# EAGLE schematic stepper-single (EAGLE 4.16)
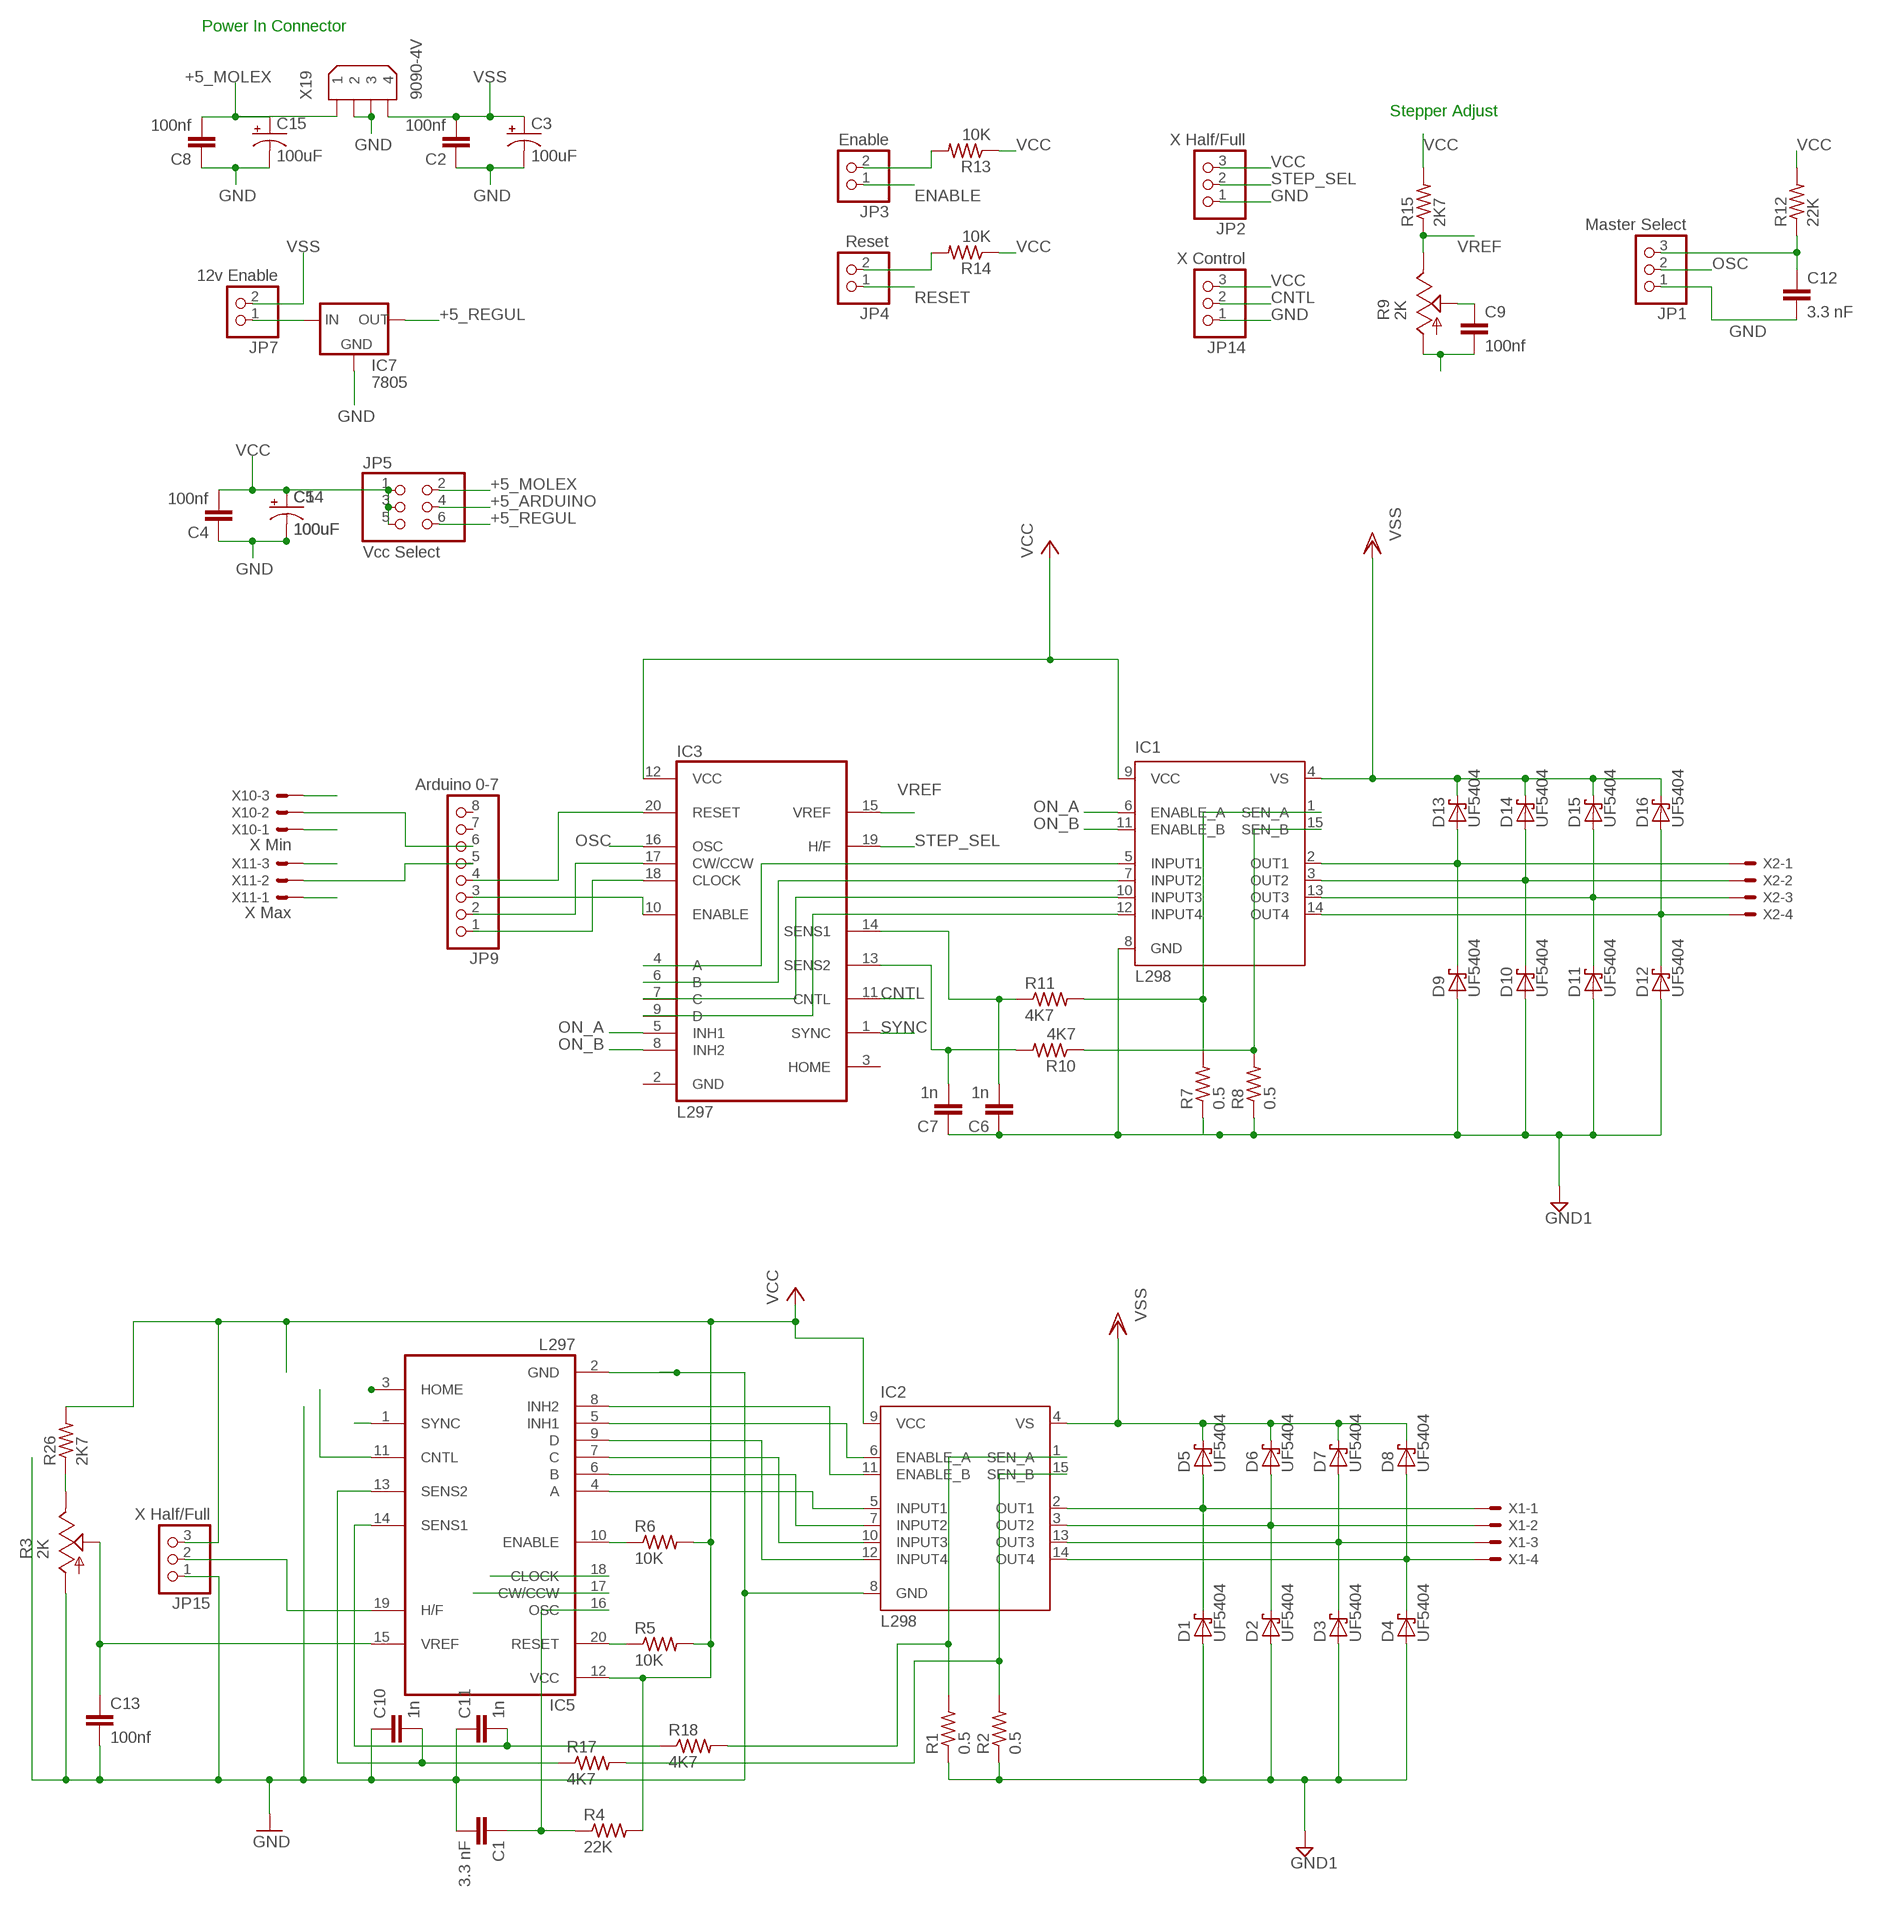
[diagram p0: schematic, sheet 1]

## Parts
C1  3.3 nF  C5/3.5  [C5B3.5]
C2  100nf  C-EU050-025X075  [C050-025X075]
C3  100uF  CPOL-USE5-6  [E5-6]
C4  100nf  C-EU050-025X075  [C050-025X075]
C5  100uF  CPOL-USE5-6  [E5-6]
C6  1n  C-EU050-030X075  [C050-030X075]
C7  1n  C-EU050-030X075  [C050-030X075]
C8  100nf  C-EU050-025X075  [C050-025X075]
C9  100nf  C-EU050-035X075  [C050-035X075]
C10  1n  C-EU050-030X075  [C050-030X075]
C11  1n  C-EU050-030X075  [C050-030X075]
C12  3.3 nF  C5/3.5  [C5B3.5]
C13  100nf  C-EU050-035X075  [C050-035X075]
C14  100uF  CPOL-USE5-6  [E5-6]
C15  100uF  CPOL-USE5-6  [E5-6]
D1  UF5404  SCHOTTKY-DIODECB429-15  [CB429-15]
D2  UF5404  SCHOTTKY-DIODECB429-15  [CB429-15]
D3  UF5404  SCHOTTKY-DIODECB429-15  [CB429-15]
D4  UF5404  SCHOTTKY-DIODECB429-15  [CB429-15]
D5  UF5404  SCHOTTKY-DIODECB429-15  [CB429-15]
D6  UF5404  SCHOTTKY-DIODECB429-15  [CB429-15]
D7  UF5404  SCHOTTKY-DIODECB429-15  [CB429-15]
D8  UF5404  SCHOTTKY-DIODECB429-15  [CB429-15]
D9  UF5404  SCHOTTKY-DIODECB429-15  [CB429-15]
D10  UF5404  SCHOTTKY-DIODECB429-15  [CB429-15]
D11  UF5404  SCHOTTKY-DIODECB429-15  [CB429-15]
D12  UF5404  SCHOTTKY-DIODECB429-15  [CB429-15]
D13  UF5404  SCHOTTKY-DIODECB429-15  [CB429-15]
D14  UF5404  SCHOTTKY-DIODECB429-15  [CB429-15]
D15  UF5404  SCHOTTKY-DIODECB429-15  [CB429-15]
D16  UF5404  SCHOTTKY-DIODECB429-15  [CB429-15]
IC1  L298  [MULTIWATT-15]
IC2  L298  [MULTIWATT-15]
IC3  L297  [DIL20]
IC5  L297  [DIL20]
IC7  7805  78XXS  [78XXS]
JP1  Master Select  PINHD-1X3  [1X03]
JP2  X Half/Full  PINHD-1X3  [1X03]
JP3  Enable  PINHD-1X2  [1X02]
JP4  Reset  PINHD-1X2  [1X02]
JP5  Vcc Select  PINHD-2X3  [2X03]
JP7  12v Enable  PINHD-1X2  [1X02]
JP9  Arduino 0-7  PINHD-1X8  [1X08]
JP14  X Control  PINHD-1X3  [1X03]
JP15  X Half/Full  PINHD-1X3  [1X03]
R1  0.5  R-US_0309/12  [0309/12]
R2  0.5  R-US_0309/12  [0309/12]
R3  2K  TRIM_US-B25U  [B25U]
R4  22K  R-US_0204/7  [0204/7]
R5  10K  R-US_0207/10  [0207/10]
R6  10K  R-US_0207/10  [0207/10]
R7  0.5  R-US_0309/12  [0309/12]
R8  0.5  R-US_0309/12  [0309/12]
R9  2K  TRIM_US-B25U  [B25U]
R10  4K7  R-US_0207/7  [0207/7]
R11  4K7  R-US_0207/7  [0207/7]
R12  22K  R-US_0204/7  [0204/7]
R13  10K  R-US_0207/7  [0207/7]
R14  10K  R-US_0207/7  [0207/7]
R15  2K7  R-US_0207/7  [0207/7]
R17  4K7  R-US_0207/7  [0207/7]
R18  4K7  R-US_0207/7  [0207/7]
R26  2K7  R-US_0207/7  [0207/7]
X1  KK-156-4  [KK-156-4]
X2  KK-156-4  [KK-156-4]
X10  X Min  22-23-2031  [22-23-2031]
X11  X Max  22-23-2031  [22-23-2031]
X19  9090-4V  [9090-4V]

## Nets
+5_ARDUINO: JP5.4
+5_MOLEX: C8.2 C15.+ JP5.2 X19.1
+5_REGUL: IC7.OUT JP5.6
CNTL [Power]: IC3.11(CNTL) JP14.2
ENABLE: JP3.1
GND [Ground]: C1.2 C2.1 C3.- C4.1 C5.- C8.1 C9.2 C10.1 C11.1 C12.2 C13.2 C14.- C15.- IC2.8(GND) IC5.2(GND) IC7.GND JP1.1 JP2.1 JP14.1 JP15.1 R3.A R9.A X19.2 X19.3
GND1 [Power]: C6.1 C7.1 D1.A D2.A D3.A D4.A D9.A D10.A D11.A D12.A IC1.8(GND) R1.1 R2.1 R7.1 R8.1
N$1: IC2.11(ENABLE_B) IC5.8(INH2)
N$2: IC2.6(ENABLE_A) IC5.5(INH1)
N$3: IC2.12(INPUT4) IC5.9(D)
N$4: IC2.10(INPUT3) IC5.7(C)
N$5: IC2.7(INPUT2) IC5.6(B)
N$6: IC2.5(INPUT1) IC5.4(A)
N$7: C1.1 IC5.16(OSC) R4.1
N$8: C11.2 IC5.14(SENS1) R18.1
N$9: IC2.15(SEN_B) R2.2 R17.2
N$10: IC5.17(CW/CCW)
N$11: IC5.18(CLOCK)
N$12: IC2.1(SEN_A) R1.2 R18.2
N$13 [Power]: D4.C D8.A IC2.14(OUT4) X1.4
N$14: IC5.10(ENABLE) R6.1
N$15: IC5.20(RESET) R5.1
N$16: X10.3
N$17: IC7.IN JP7.1
N$18: IC5.19(H/F) JP15.2
N$19: IC3.18(CLOCK) JP9.1
N$20 [Power]: D3.C D7.A IC2.13(OUT3) X1.3
N$21: R3.E R26.1
N$22 [Power]: D2.C D6.A IC2.3(OUT2) X1.2
N$23: IC3.17(CW/CCW) JP9.2
N$24: X10.1
N$25: IC1.5(INPUT1) IC3.4(A)
N$26: IC1.7(INPUT2) IC3.6(B)
N$27 [Power]: D12.C D16.A IC1.14(OUT4) X2.4
N$28 [Power]: D11.C D15.A IC1.13(OUT3) X2.3
N$29 [Power]: D10.C D14.A IC1.3(OUT2) X2.2
N$30 [Power]: D9.C D13.A IC1.2(OUT1) X2.1
N$31: IC1.10(INPUT3) IC3.7(C)
N$32: IC1.15(SEN_B) R8.2 R10.1
N$33: IC1.1(SEN_A) R7.2 R11.2
N$34: IC1.12(INPUT4) IC3.9(D)
N$35: IC3.10(ENABLE) JP9.3
N$36: C7.2 IC3.13(SENS2) R10.2
N$37: C6.2 IC3.14(SENS1) R11.1
N$38: JP9.6 X10.2
N$39: IC3.20(RESET) JP9.4
N$40: JP3.2 R13.2
N$41: C12.1 JP1.3 R12.1
N$42: JP4.2 R14.2
N$43: JP9.5 X11.2
N$44: X11.3
N$45: X11.1
N$46: C9.1 R9.S
N$75 [Power]: D1.C D5.A IC2.2(OUT1) X1.1
N$76: C10.2 IC5.13(SENS2) R17.1
N$77: C13.1 IC5.15(VREF) R3.S
N$78: IC5.11(CNTL)
N$95: IC5.3(HOME)
N$103: IC5.1(SYNC)
ON_A: IC1.6(ENABLE_A) IC3.5(INH1)
ON_B: IC1.11(ENABLE_B) IC3.8(INH2)
OSC: IC3.16(OSC) JP1.2
RESET: JP4.1
STEP_SEL: IC3.19(H/F) JP2.2
SYNC: IC3.1(SYNC)
VCC: C4.2 C5.+ C14.+ IC1.9(VCC) IC2.9(VCC) IC3.12(VCC) IC5.12(VCC) JP2.3 JP5.1 JP5.3 JP5.5 JP14.3 JP15.3 R4.2 R5.2 R6.2 R12.2 R13.1 R14.1 R15.2 R26.2
VREF: IC3.15(VREF) R9.E R15.1
VSS [Power]: C2.2 C3.+ D5.C D6.C D7.C D8.C D13.C D14.C D15.C D16.C IC1.4(VS) IC2.4(VS) JP7.2 X19.4
Unconnected: IC3.3(HOME) JP9.7 JP9.8

## Notes on the sheet
- Power In Connector
- Stepper Adjust

## Power pins joined to a net without a drawn wire
GND: IC3.2(GND)

## Library data of the parts
C1 C12 = capacitor-wima:C: CAPACITOR naming: grid - package width
C2 C4 C6-C11 C13 = rcl:C-EU: CAPACITOR, European symbol
C3 C5 C14 C15 = rcl:CPOL-US: POLARIZED CAPACITOR, American symbol
D1-D16 = diode:SCHOTTKY-DIODE: Schottky Diode
IC1 IC2 = st-microelectronics:L298: DUAL FULL-BRIDGE DRIVER
IC3 IC5 = st-microelectronics:L297: STEPPER MOTOR CONTROLLER
IC7 = cls:78XXS: VOLTAGE REGULATOR
JP1 JP2 JP14 JP15 = pinhead:PINHD-1X3: PIN HEADER
JP3 JP4 JP7 = pinhead:PINHD-1X2: PIN HEADER
JP5 = pinhead:PINHD-2X3: PIN HEADER
JP9 = pinhead:PINHD-1X8: PIN HEADER
R1 R2 R4-R8 R10-R15 R17 R18 R26 = rcl:R-US_: RESISTOR, American symbol
R3 R9 = pot:TRIM_US-: POTENTIOMETER
X1 X2 = con-molex:KK-156-4: KK 156 HEADER Source: http://www.molex.com/pdm_docs/sd/026604100_sd.pdf
X10 X11 = con-molex:22-23-2031: .100" (2.54mm) Center Header - 3 Pin
X19 = con-thomas-betts:9090-4: Disk Drive Power four position Source: Thomas & Betts Electronic Interconnects Eiropean Edition 1998

## Net classes
1 Power: width 1.524 mm, drill 0.381 mm
2 Signal: width 0.508 mm, drill 0.381 mm
3 Ground: width 0.762 mm, drill 0.381 mm